# Altium project Board1.PrjPCB
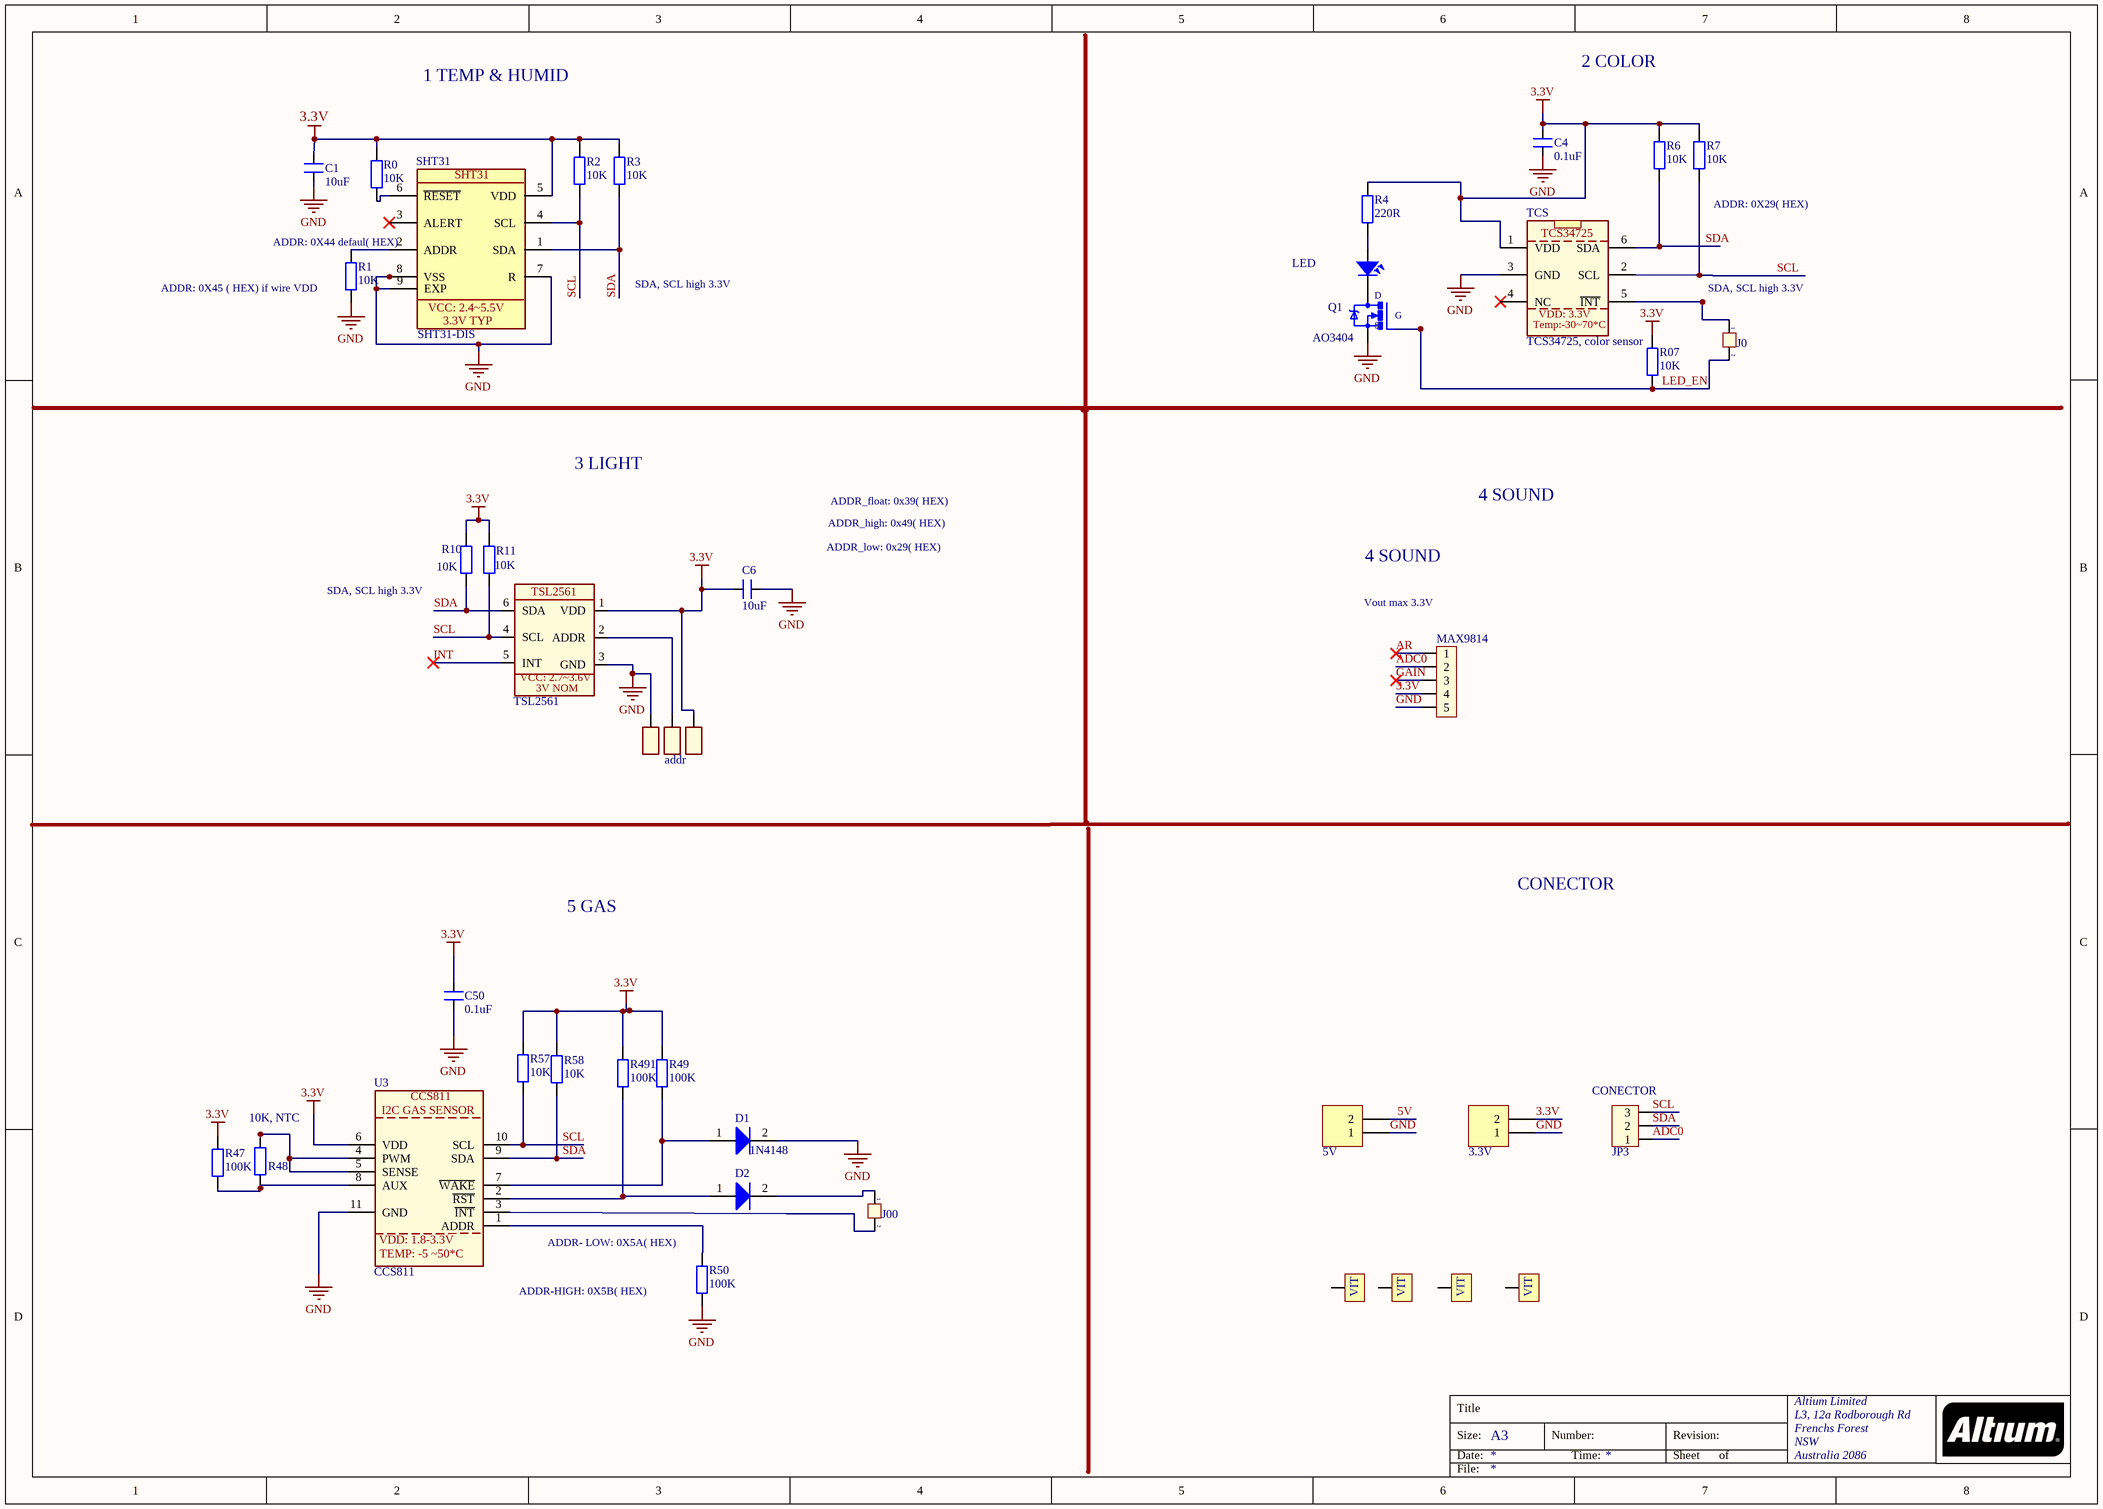
[diagram p0: BOARD1.SchDoc]
1 sheet, 42 parts. Net scope: global (net labels, ports and power ports of the same name join across sheets).
Board file: board1.PcbDoc

## Sheet BOARD1.SchDoc
size A3; Organization: Altium Limited; Address1: L3, 12a Rodborough Rd; Address2: Frenchs Forest; Address3: NSW; Address4: Australia 2086

### Parts
3.3V  Header 2_1  [JP2F]  (value not drawn)
5V  Header 2_1  [JP2F]  (value not drawn)
?  TSL2561  [TMB6 Pin_picth0.95]
a0  SIP1  [Pad]  (value not drawn)
a2  SIP1  [Pad]  (value not drawn)
addr  SIP1  [Pad]  (value not drawn)
C1  10uF  [SM-CAP-0805]
C4  0.1uF  [SM-CAP-0805]
C6  10uF  [SM-CAP-0805]
C50  0.1uF  [SM-CAP-0805]
CONECTOR  JP3  [JP3F]
D1  1N4148  [SOD-3232F_]
D2  1N4148  [SOD-3232F_]  (value not drawn)
J0  Jumper 2  [JP2]  (value not drawn)
J00  Jumper 2  [JP2]  (value not drawn)
LED  LED SMD  [SM-LED-1206-invisible]  (value not drawn)
MAX9814  JP5  [JP5F]  (value not drawn)
Q1  AO3404  [SOT23 - BSS138]
R0  10K  [SM-RES-0805]
R1  10K  [SM-RES-0805]
R2  10K  [SM-RES-0805]
R3  10K  [SM-RES-0805]
R4  220R  [SM-RES-0805]
R6  10K  [SM-RES-0805]
R7  10K  [SM-RES-0805]
R07  10K  [SM-RES-0805]
R10  10K  [SM-RES-0805]
R11  10K  [SM-RES-0805]
R47  100K  [SM-RES-0805]
R48  10K, NTC  [NTC]
R49  100K  [SM-RES-0805]
R50  100K  [SM-RES-0805]
R57  10K  [SM-RES-0805]
R58  10K  [SM-RES-0805]
R491  100K  [SM-RES-0805]
SHT31  SHT31-DIS  [SON50P250X250X100-9N]
TCS  TCS34725, color sensor  [TCS34725]
U3  CCS811  [CCS811]
VIT1  1  [VIT]  (value not drawn)
VIT2  1  [VIT]  (value not drawn)
VIT3  1  [VIT]  (value not drawn)
VIT4  1  [VIT]  (value not drawn)

### Nets
3.3V: 3.3V.2 ?.1(VDD) a2.1 C1.2 C4.2 C6.2 C50.1 MAX9814.4 R0.2 R2.2 R3.2 R4.2 R6.2 R7.2 R07.2 R10.2 R11.1 R47.2 R49.2 R57.2 R58.2 R491.2 SHT31.5(VDD) TCS.1(VDD) U3.6(VDD)
GND: 3.3V.1 5V.1 ?.3(GND) a0.1 C1.1 C4.1 C6.1 C50.2 D1.2(K) MAX9814.5 Q1.S R1.1 R50.1 SHT31.7(R) SHT31.8(VSS) SHT31.9(EXP) TCS.3(GND) U3.11(GND)
5V: 5V.2
ADC0: CONECTOR.1 MAX9814.2
AR: MAX9814.1
GAIN: MAX9814.3
INT: ?.5(INT)
LED_EN: J0.2 Q1.G R07.1
SCL: ?.4(SCL) CONECTOR.3 R2.1 R7.1 R11.2 R57.1 SHT31.4(SCL) TCS.2(SCL) U3.10(SCL)
SDA: ?.6(SDA) CONECTOR.2 R3.1 R6.1 R10.1 R58.1 SHT31.1(SDA) TCS.6(SDA) U3.9(SDA)
Net?_2: ?.2(ADDR) addr.1
NetD1_1: D1.1(A) R49.1 U3.7(~{WAKE})
NetD2_1: D2.1(A) R491.1 U3.2(~{RST})
NetD2_2: D2.2(K) J00.1
NetJ0_1: J0.1 TCS.5(~{INT})
NetJ00_2: J00.2 U3.3(~{INT})
NetLED_1: LED.1 R4.1
NetLED_2: LED.2 Q1.D
NetR0_1: R0.1 SHT31.6(~{RESET})
NetR1_2: R1.2 SHT31.2(ADDR)
NetR47_1: R47.1 R48.1 U3.8(AUX)
NetR48_2: R48.2 U3.4(PWM) U3.5(SENSE)
NetR50_2: R50.2 U3.1(ADDR)

Not connected (* = marked no-connect by the designer): SHT31 3(ALERT)*; TCS 4(NC)*; VIT1 VIT1(1); VIT2 VIT1(1); VIT3 VIT1(1); VIT4 VIT1(1)

### Notes on the sheet
- 1 TEMP & HUMID
- 2 COLOR
- ADDR: 0X44 defaul( HEX)
- (near R7) ADDR: 0X29( HEX)
- (near R1) ADDR: 0X45 ( HEX) if wire VDD
- SDA, SCL high 3.3V
- (near J0) SDA, SCL high 3.3V
- 3 LIGHT
- ADDR_float: 0x39( HEX)
- 4 SOUND
- ADDR_low: 0x29( HEX)
- ADDR_high: 0x49( HEX)
- (near MAX9814) Vout max 3.3V
- 5 GAS
- CONECTOR
- ADDR- LOW: 0X5A( HEX)
- ADDR-HIGH: 0X5B( HEX)
- Title
- Size:
- Date:
- A3
- Number:
- Time:
- Revision:
- Sheet
- of
- File:
- (in symbol CCS811) I2C GAS SENSOR; VDD: 1.8-3.3V; TEMP: -5 ~50*C
- (in symbol SHT31-DIS) VCC: 2.4~5.5V; 3.3V TYP
- (in symbol TCS34725, color sensor) TCS34725; VDD: 3.3V; Temp:-30~70*C
- (in symbol TSL2561) VCC: 2.7~3.6V; 3V NOM

### Library data of the parts
3.3V 5V = Header 2_1: Header, 2-Pin; Manufacturer: Generic Components; Class: Connector; Value: Header 2
? = TSL2561: Optical Sensor Ambient 640nm IÂ²C 6-SMD, No Lead; MF: ams; Package: SMD-6 ams; Price: None; SnapEDA_Link: https://www.snapeda.com/parts/TSL2561/ams/view-part/3210049/?ref=snap; Availability: Unavailable; Value: *; MP: TSL2561
C1 = CM: Cap SMD; Value: 106
C4 = CM: Cap SMD; Value: 0.1uF
C6 C50 = CM: Cap SMD; Value: 103
CONECTOR = Con3: Connector 3; Value: Connector 3
D1 D2 = Diode: Default Diode SMD; Code - JEDEC: DO-214-AB; Value: 1N5007; Published: 8-Jun-2000; Revision: July-2002: Re-released for DXP Platform.; Publisher: Altium Limited
J0 J00 = JP 2: Value: JP 2
LED = LED-SMD-1206
Q1 = BSS138: N-CHANNEL ENHANCEMENT MODE VERTICAL DMOS FET, SOT23; MP: IRF520; MF: Vishay Siliconix; Availability: Unavailable; Package: TO-220 Vishay Siliconix; Value: AO3404; Price: None; SnapEDA_Link: https://www.snapeda.com/parts/IRF520/Vishay%20Siliconix/view-part/522447/?ref=snap
R0-R4 R6 R7 R07 R10 R11 R47-R50 R57 R58 R491 = RM: Resistor SMD; Value: 1K
SHT31 = SHT31-DIS: Humidity Temperature Sensor 0 ~ 100% RH Analog Voltage Â±2% RH 8s Surface Mount; MF: Sensirion AG; MP: SHT31-ARP-B; SnapEDA_Link: https://www.snapeda.com/parts/SHT31-ARP-B/Sensirion%20AG/view-part/1149118/?ref=snap; Availability: Unavailable; Price: None; Package: DFN-8 Sensirion; Value: *
TCS = TCS34725, color sensor: color sensor
VIT1-VIT4 = VIT: Oc Vit